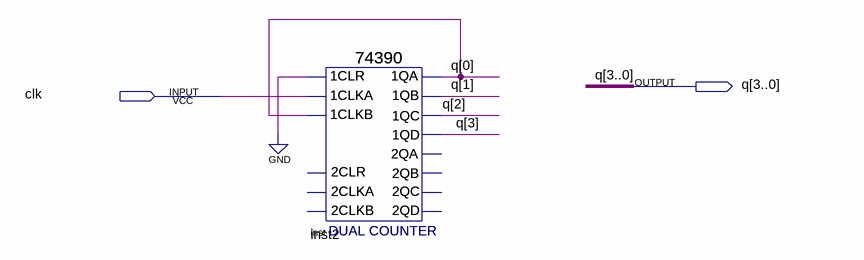
[diagram p0: schematic sheet]
// Quartus schematic cnt10.bdf as structural Verilog: 2 symbols, 2 pins
module cnt10 (
  input  clk,
  output [3:0] q
);

  wire inst_2qa, inst_2qb, inst_2qc, inst_2qd, undriven, undriven_2, undriven_3;

  \74390  inst (
    .\2CLKA (undriven_2), .\2CLR (undriven), .\2CLKB (undriven_3), .\1CLR (1'b0), .\1CLKA (clk),
    .\1CLKB (q[0]), .\1QA (q[0]), .\1QB (q[1]), .\1QC (q[2]), .\1QD (q[3]), .\2QA (inst_2qa),
    .\2QB (inst_2qb), .\2QC (inst_2qc), .\2QD (inst_2qd));
  \74390  inst2 (
    .\2CLKA (undriven_2), .\2CLR (undriven), .\2CLKB (undriven_3), .\1CLR (1'b0), .\1CLKA (clk),
    .\1CLKB (q[0]), .\1QA (q[0]), .\1QB (q[1]), .\1QC (q[2]), .\1QD (q[3]), .\2QA (inst_2qa),
    .\2QB (inst_2qb), .\2QC (inst_2qc), .\2QD (inst_2qd));
endmodule
